# Altium schematic sheet RGMII ETH PHY.SchDoc
size A4; SheetNumber: 18; SheetTotal: 26
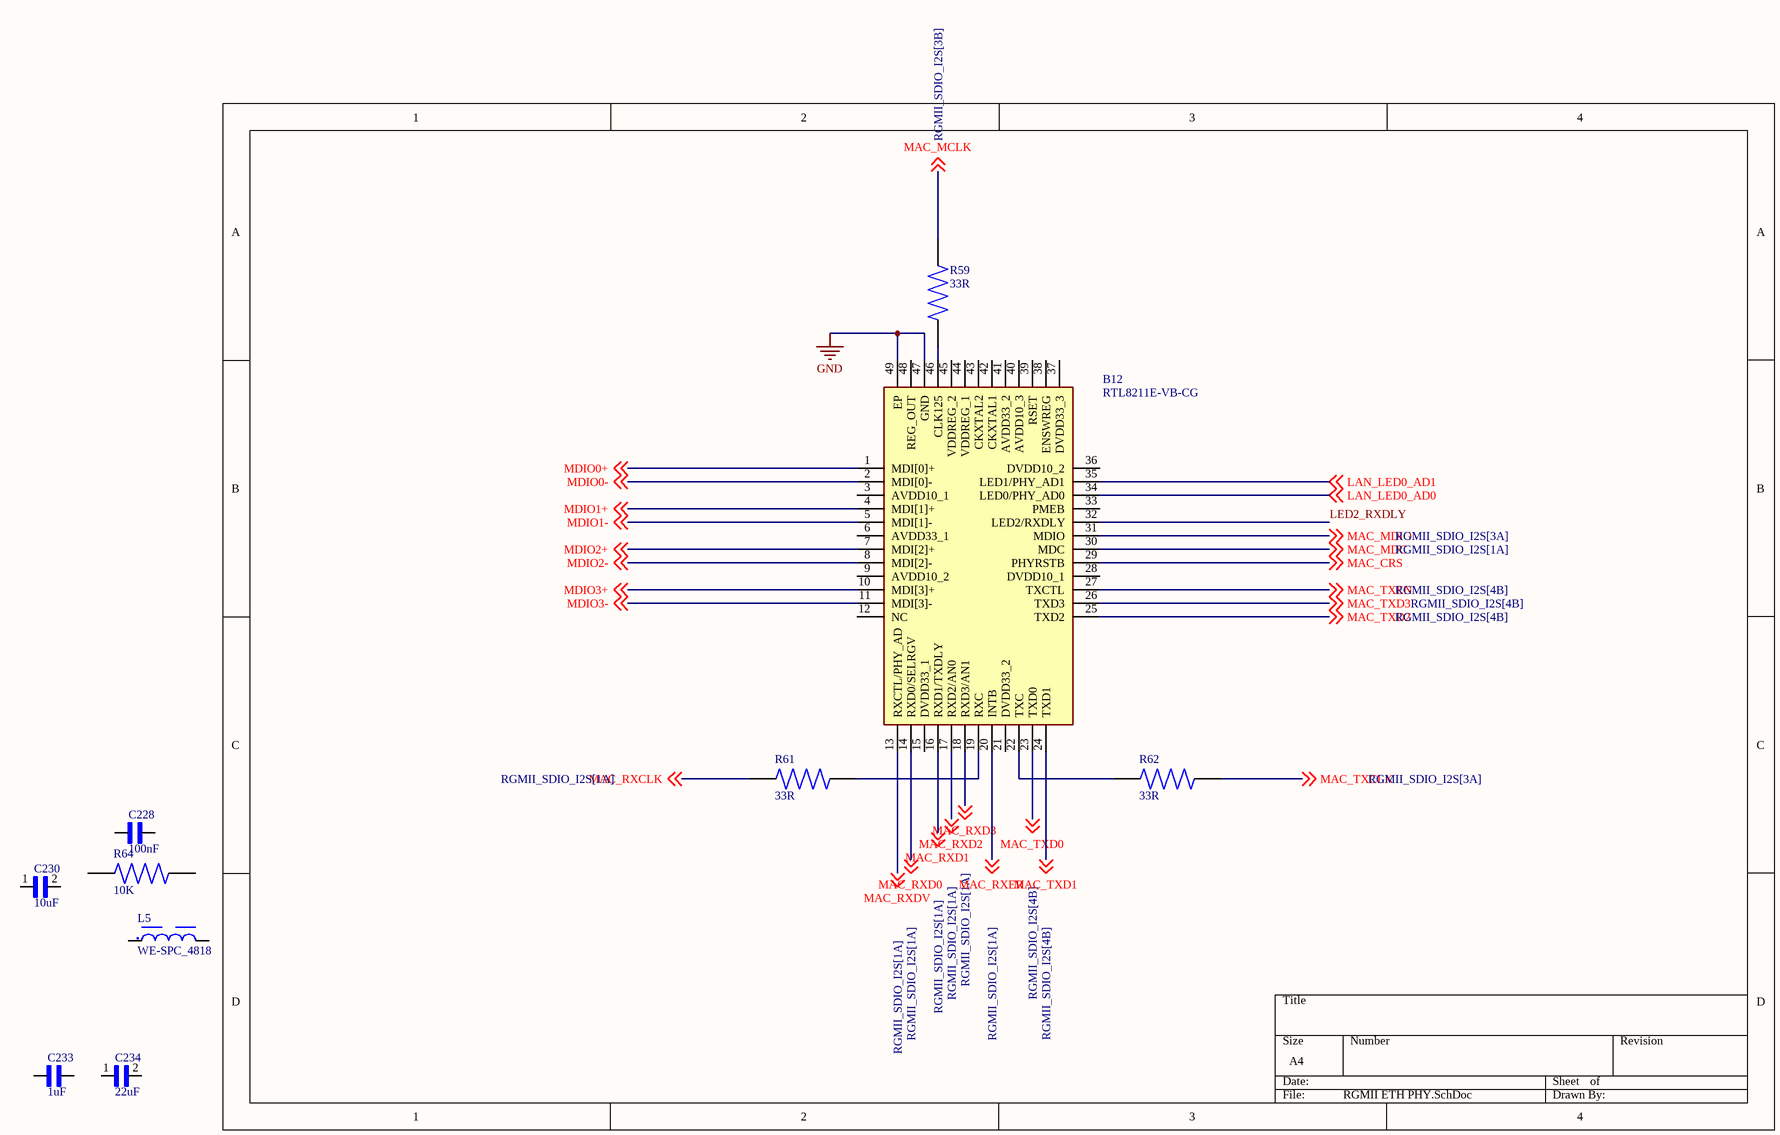
[diagram p0: RGMII ETH PHY.SchDoc]

## Parts
B12  RTL8211E-VB-CG  [QFN40P600X600X100-49N]
C228  100nF  [CAPC2012X90N]
C230  10uF  [CAPC5035X300N]
C233  1uF  [CAPC3225X140N]
C234  22uF  [CAPC6050X550N]
L5  WE-SPC_4818  [WE-SPC_4818]
R59  33R  [RES_ERA6AHD330V]
R61  33R  [RES_ERA6AHD330V]
R62  33R  [RES_ERA6AHD330V]
R64  10K  [RES_ERA3ARB103V]

## Nets
GND: B12.47(GND) B12.49(EP)
LAN_LED0_AD0: B12.34(LED0/PHY_AD0) ; off-sheet LAN_LED0_AD0
LAN_LED0_AD1: B12.35(LED1/PHY_AD1) ; off-sheet LAN_LED0_AD1
LED2_RXDLY: B12.32(LED2/RXDLY)
MAC_CRS: B12.29(PHYRSTB) ; off-sheet MAC_CRS
MAC_MCLK: R59.1 ; off-sheet MAC_MCLK
MAC_MDC: B12.30(MDC) ; off-sheet MAC_MDC
MAC_MDIO: B12.31(MDIO) ; off-sheet MAC_MDIO
MAC_RXCLK: R61.2 ; off-sheet MAC_RXCLK
MAC_RXD0: B12.14(RXD0/SELRGV) ; off-sheet MAC_RXD0
MAC_RXD1: B12.16(RXD1/TXDLY) ; off-sheet MAC_RXD1
MAC_RXD2: B12.17(RXD2/AN0) ; off-sheet MAC_RXD2
MAC_RXD3: B12.18(RXD3/AN1) ; off-sheet MAC_RXD3
MAC_RXDV: B12.13(RXCTL/PHY_AD) ; off-sheet MAC_RXDV
MAC_RXER: B12.20(INTB) ; off-sheet MAC_RXER
MAC_TXCLK: R62.1 ; off-sheet MAC_TXCLK
MAC_TXD0: B12.23(TXD0) ; off-sheet MAC_TXD0
MAC_TXD1: B12.24(TXD1) ; off-sheet MAC_TXD1
MAC_TXD2: B12.25(TXD2) ; off-sheet MAC_TXD2
MAC_TXD3: B12.26(TXD3) ; off-sheet MAC_TXD3
MAC_TXEN: B12.27(TXCTL) ; off-sheet MAC_TXEN
MDIO0+: B12.1(MDI[0]+) ; off-sheet MDIO0+
MDIO0-: B12.2(MDI[0]-) ; off-sheet MDIO0-
MDIO1+: B12.4(MDI[1]+) ; off-sheet MDIO1+
MDIO1-: B12.5(MDI[1]-) ; off-sheet MDIO1-
MDIO2+: B12.7(MDI[2]+) ; off-sheet MDIO2+
MDIO2-: B12.8(MDI[2]-) ; off-sheet MDIO2-
MDIO3+: B12.10(MDI[3]+) ; off-sheet MDIO3+
MDIO3-: B12.11(MDI[3]-) ; off-sheet MDIO3-
NetB12_19: B12.19(RXC) R61.1
NetB12_22: B12.22(TXC) R62.2
NetB12_46: B12.46(CLK125) R59.2

Not connected (* = marked no-connect by the designer): B12 3(AVDD10_1) 6(AVDD33_1) 9(AVDD10_2) 12(NC) 15(DVDD33_1) 21(DVDD33_2) 28(DVDD10_1) 33(PMEB) 36(DVDD10_2) 37(DVDD33_3) 38(ENSWREG) 39(RSET) 40(AVDD10_3) 41(AVDD33_2) 42(CKXTAL1) 43(CKXTAL2) 44(VDDREG_1) 45(VDDREG_2) 48(REG_OUT); C228 1 2; C230 1 2; C233 1 2; C234 1 2; L5 1 2; R64 1 2

## Library data of the parts
B12 = RTL8211E-VB-CG: h; Manufacturer_Name: Realtek; Geometry.Height: 1mm; Manufacturer_Part_Number: RTL8211E-VB-CG; Mouser Part Number: *; Mouser Price/Stock: *; Arrow Part Number: *; Arrow Price/Stock: *; Datasheet Link: http://download3.dvd-driver.cz/realtek/datasheets/pdf/rtl8211e(g)-vb(vl)-cg_datasheet_1.6.pdf
C228 = VJ0805Y104KXXCW1BC: Capacitor: ceramic; MLCC; 100nF; 25V; X7R; Â±10%; SMD; 0805; MF: Vishay Vitramon; SnapEDA_Link: https://www.snapeda.com/parts/VJ0805Y104KXXCW1BC/Vishay/view-part/?ref=snap; Package: 0805-2 VISHAY; Value: *; MP: VJ0805Y104KXXCW1BC; Check_prices: https://www.snapeda.com/parts/VJ0805Y104KXXCW1BC/Vishay/view-part/?ref=eda
C230 = CKG45KX7R1C106M290JH: 10ÂµF Â±20% 16V Ceramic Capacitor X7R Nonstandard SMD; MF: TDK; SnapEDA_Link: https://www.snapeda.com/parts/CKG45KX7R1C106M290JH/TDK/view-part/?ref=snap; Package: 5035 TDK; Value: *; MP: CKG45KX7R1C106M290JH; Check_prices: https://www.snapeda.com/parts/CKG45KX7R1C106M290JH/TDK/view-part/?ref=eda
C233 = C1210C105K5RACTU: Capacitor;Ceramic;Cap;1.00uF;Tol+10%;SMT;Vol-Rtg 50V;High Cap.;X7R;TR | KEMET C1210C105K5RACTU; SnapEDA_Link: https://www.snapeda.com/parts/C1210C105K5RACTU/KEMET/view-part/?ref=snap; Package: 1210-2 KEMET; Value: *; MF: KEMET; MP: C1210C105K5RACTU; Check_prices: https://www.snapeda.com/parts/C1210C105K5RACTU/KEMET/view-part/?ref=eda
C234 = CKG57NX7S1H226M500JJ: 22ÂµF Â±20% 50V Ceramic Capacitor X7S Stacked SMD, 2 J-Lead; MP: CKG57NX7S1H226M500JJ; Package: None; Availability: Unavailable; Price: None; Value: *
L5 = WE-SPC_4818: 10 ÂµH Shielded Drum Core, Wirewound Inductor 900 mA 248mOhm Max 1919 (4848 Metric); MF: WÃ¼rth Elektronik; MP: 74408941100; SnapEDA_Link: https://www.snapeda.com/parts/74408941100/W%25C3%25BCrth+Elektronik+Midcom/view-part/?ref=snap; Package: 1919 WÃ¼rth Elektronik; Value: *; Check_prices: https://www.snapeda.com/parts/74408941100/W%25C3%25BCrth+Elektronik+Midcom/view-part/?ref=eda
R59 R61 R62 = ERA6AHD330V: Package: None; MP: ERA6AHD330V; Price: None; Value: *; Availability: Unavailable
R64 = ERA3ARB103V: MP: ERA3ARB103V; Availability: Unavailable; Package: None; Value: *; Price: None